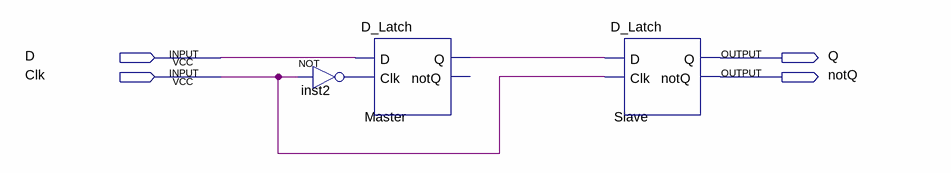
[diagram p0: schematic sheet]
// Quartus schematic D_FlipFlop.bdf as structural Verilog: 3 symbols, 4 pins
module D_FlipFlop (
  input  D,
  input  Clk,
  output Q,
  output notQ
);

  wire inst2_out, Master_q;

  not inst2 (inst2_out, Clk);
  D_Latch Master (.D(D), .Clk(inst2_out), .Q(Master_q));  // open: notQ
  D_Latch Slave (.D(Master_q), .Clk(Clk), .Q(Q), .notQ(notQ));
endmodule
